# Altium schematic sheet main.SchDoc
size A; SheetNumber: 1
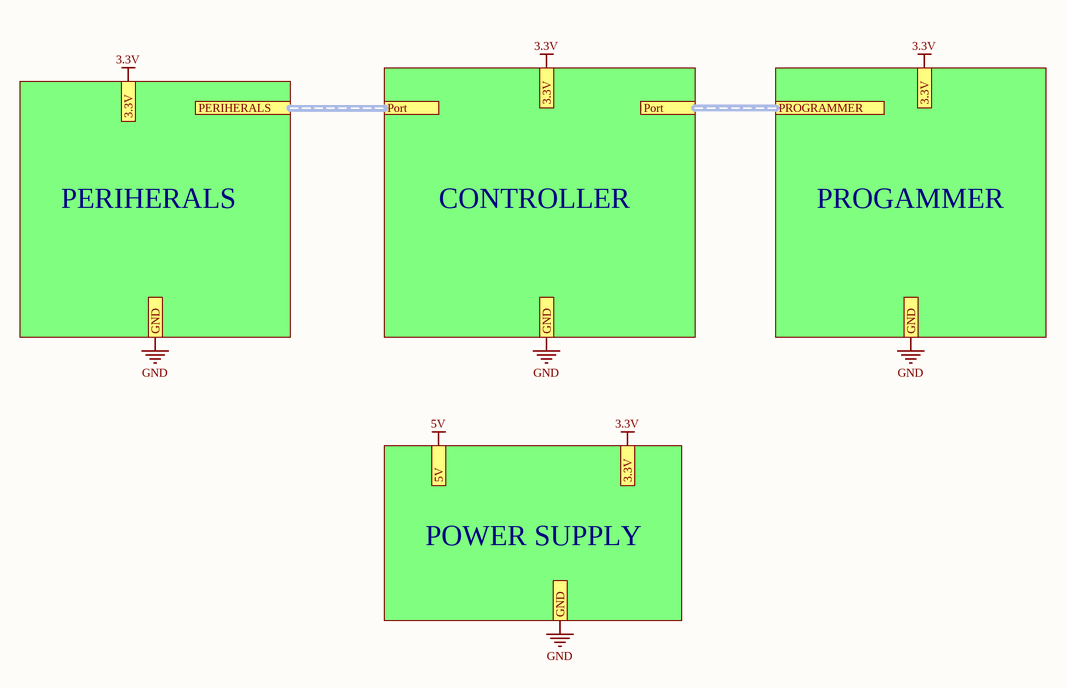
[diagram p0: main.SchDoc]

## Sub-sheets
CONTROLLER = controller.SchDoc: no entries
PERIHERALS = INPUT AND OUPUT.SchDoc: no entries
POWER SUPPLY = PowerSupply.SchDoc: no entries
PROGAMMER = Programmer.SchDoc: no entries

## Ports
3.3V, 5V, GND, PERIHERALS (harness PERIHERALS), Port, PROGRAMMER (harness PROGRAMMER)

## Nets
3.3V: port 3.3V
5V: port 5V
GND: port GND

## Buses and harness runs
harness port PERIHERALS = port Port
harness port Port = port PROGRAMMER